# EAGLE schematic schematic (EAGLE 7.5.0)
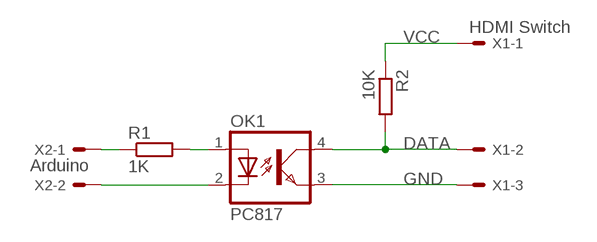
[diagram p0: schematic, sheet 1]

## Parts
OK1  PC817  [DIL04]
R1  1K  R-EU_0207/10  [0207/10]
R2  10K  R-EU_0207/10  [0207/10]
X1  HDMI Switch  22-23-2031  [22-23-2031]
X2  Arduino  22-23-2021  [22-23-2021]

## Nets
DATA: OK1.4(COL) R2.2 X1.2
GND: OK1.3(EMIT) X1.3
N$1: OK1.1(A) R1.2
N$2: R1.1 X2.1
N$3: OK1.2(C) X2.2
VCC: R2.1 X1.1

## Library data of the parts
OK1 = optocoupler:PC817: SHARP OPTO COUPLER; MPN: PC817X4J000F; OC_FARNELL: 9707727; OC_NEWARK: 97K7059
R1 R2 = rcl:R-EU_: RESISTOR, European symbol
X1 = con-molex:22-23-2031: .100" (2.54mm) Center Header - 3 Pin; MF: MOLEX; MPN: 22-23-2031; OC_FARNELL: 1462950; OC_NEWARK: 30C0862
X2 = con-molex:22-23-2021: .100" (2.54mm) Center Header - 2 Pin; MF: MOLEX; MPN: 22-23-2021; OC_FARNELL: 1462926; OC_NEWARK: 25C3832